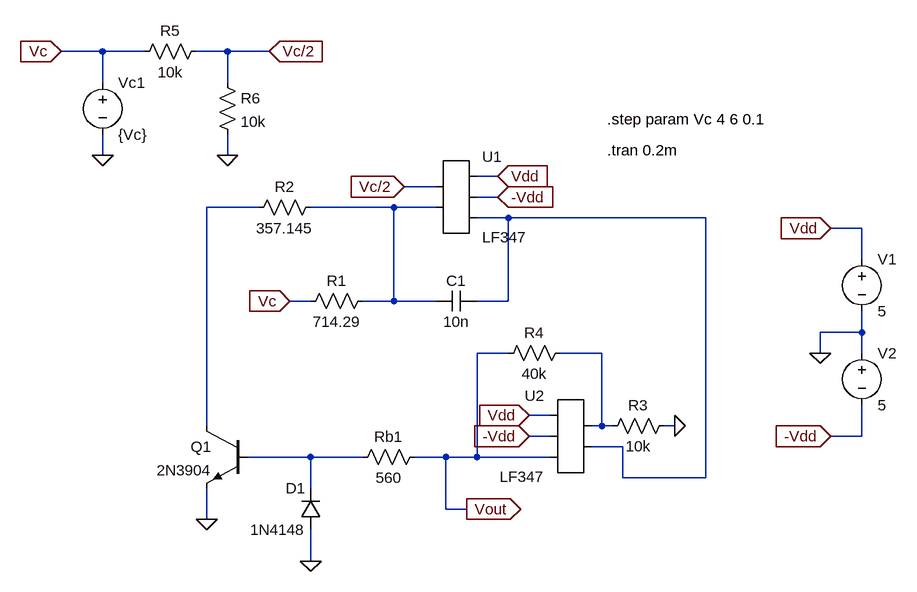
[diagram p0: schematic Q3.1.asc]
Q3.1.asc, the LTspice schematic file:
Version 4
SHEET 1 972 768
WIRE -256 -32 -320 -32
WIRE -192 -32 -256 -32
WIRE -64 -32 -112 -32
WIRE 0 -32 -64 -32
WIRE -256 16 -256 -32
WIRE -64 16 -64 -32
WIRE -256 128 -256 96
WIRE -64 128 -64 96
WIRE 352 160 320 160
WIRE 256 176 208 176
WIRE 352 192 320 192
WIRE -16 208 -96 208
WIRE 192 208 64 208
WIRE 256 208 192 208
WIRE 368 224 320 224
WIRE 672 224 368 224
WIRE 912 240 864 240
WIRE 912 288 912 240
WIRE 64 352 32 352
WIRE 192 352 192 208
WIRE 192 352 144 352
WIRE 256 352 192 352
WIRE 368 352 368 224
WIRE 368 352 320 352
WIRE 912 400 912 368
WIRE 912 400 848 400
WIRE 368 432 320 432
WIRE 512 432 448 432
WIRE 848 432 848 400
WIRE 912 432 912 400
WIRE 432 528 400 528
WIRE -96 544 -96 208
WIRE 512 544 512 432
WIRE 512 544 496 544
WIRE 528 544 512 544
WIRE 624 544 608 544
WIRE 432 560 400 560
WIRE 912 560 912 512
WIRE 912 560 864 560
WIRE 544 576 496 576
WIRE 64 592 -32 592
WIRE 144 592 64 592
WIRE 272 592 224 592
WIRE 320 592 320 432
WIRE 320 592 272 592
WIRE 432 592 320 592
WIRE 544 624 544 576
WIRE 672 624 672 224
WIRE 672 624 544 624
WIRE 64 640 64 592
WIRE 272 672 272 592
WIRE 304 672 272 672
WIRE -96 688 -96 640
WIRE 64 752 64 704
FLAG 848 432 0
FLAG 864 240 Vdd
IOPIN 864 240 In
FLAG 864 560 -Vdd
IOPIN 864 560 In
FLAG 352 160 Vdd
IOPIN 352 160 In
FLAG 352 192 -Vdd
IOPIN 352 192 In
FLAG 624 544 0
FLAG 400 528 Vdd
IOPIN 400 528 In
FLAG 400 560 -Vdd
IOPIN 400 560 In
FLAG -96 688 0
FLAG -256 128 0
FLAG -64 128 0
FLAG -320 -32 Vc
IOPIN -320 -32 In
FLAG 0 -32 Vc/2
IOPIN 0 -32 In
FLAG 208 176 Vc/2
IOPIN 208 176 In
FLAG 32 352 Vc
IOPIN 32 352 In
FLAG 64 752 0
FLAG 304 672 Vout
IOPIN 304 672 Out
SYMBOL AutoGenerated/LF347 288 192 R0
SYMATTR InstName U1
SYMBOL res 160 336 R90
WINDOW 0 0 56 VBottom 2
WINDOW 3 32 56 VTop 2
SYMATTR InstName R1
SYMATTR Value 714.29
SYMBOL cap 320 336 R90
WINDOW 0 0 32 VBottom 2
WINDOW 3 32 32 VTop 2
SYMATTR InstName C1
SYMATTR Value 10n
SYMBOL voltage 912 272 R0
SYMATTR InstName V1
SYMATTR Value 5
SYMBOL voltage 912 416 R0
SYMATTR InstName V2
SYMATTR Value 5
SYMBOL res 80 192 R90
WINDOW 0 0 56 VBottom 2
WINDOW 3 32 56 VTop 2
SYMATTR InstName R2
SYMATTR Value 357.145
SYMBOL npn -32 544 M0
SYMATTR InstName Q1
SYMATTR Value 2N3904
SYMBOL AutoGenerated/LF347 464 560 M0
SYMATTR InstName U2
SYMBOL res 624 528 R90
WINDOW 0 0 56 VBottom 2
WINDOW 3 32 56 VTop 2
SYMATTR InstName R3
SYMATTR Value 10k
SYMBOL res 464 416 R90
WINDOW 0 0 56 VBottom 2
WINDOW 3 32 56 VTop 2
SYMATTR InstName R4
SYMATTR Value 40k
SYMBOL res 240 576 R90
WINDOW 0 0 56 VBottom 2
WINDOW 3 32 56 VTop 2
SYMATTR InstName Rb1
SYMATTR Value 560
SYMBOL voltage -256 0 R0
SYMATTR InstName Vc1
SYMATTR Value {Vc}
SYMBOL res -96 -48 R90
WINDOW 0 0 56 VBottom 2
WINDOW 3 32 56 VTop 2
SYMATTR InstName R5
SYMATTR Value 10k
SYMBOL res -80 0 R0
SYMATTR InstName R6
SYMATTR Value 10k
SYMBOL diode 80 704 R180
WINDOW 0 24 64 Left 2
WINDOW 3 24 0 Left 2
SYMATTR InstName D1
SYMATTR Value 1N4148
TEXT 520 120 Left 2 !.tran 0.2m
TEXT 520 72 Left 2 !.step param Vc 4 6 0.1

The netlist it stands for:
* Q3.1.asc
* U1: LF347 (symbol AutoGenerated/LF347 not available, pins judged from their places): pin1=Vc/2 pin2=N002 pin3=Vdd pin4=-Vdd pin5=N003
R1 N002 Vc 714.29
C1 N003 N002 10n
V1 Vdd 0 5
V2 0 -Vdd 5
R2 N002 N001 357.145
Q1 N001 N005 0 0 2N3904
* U2: LF347 (symbol AutoGenerated/LF347 not available, pins judged from their places): pin1=N004 pin2=N003 pin3=Vdd pin4=-Vdd pin5=Vout
R3 0 N004 10k
R4 N004 Vout 40k
Rb1 Vout N005 560
Vc1 Vc 0 {Vc}
R5 Vc/2 Vc 10k
R6 Vc/2 0 10k
D1 0 N005 1N4148
.model D D
.lib standard.dio
.model NPN NPN
.model PNP PNP
.lib standard.bjt
.tran 0.2m
.step param Vc 4 6 0.1
.backanno
.end